# EAGLE design FLASH (EAGLE 6.2)
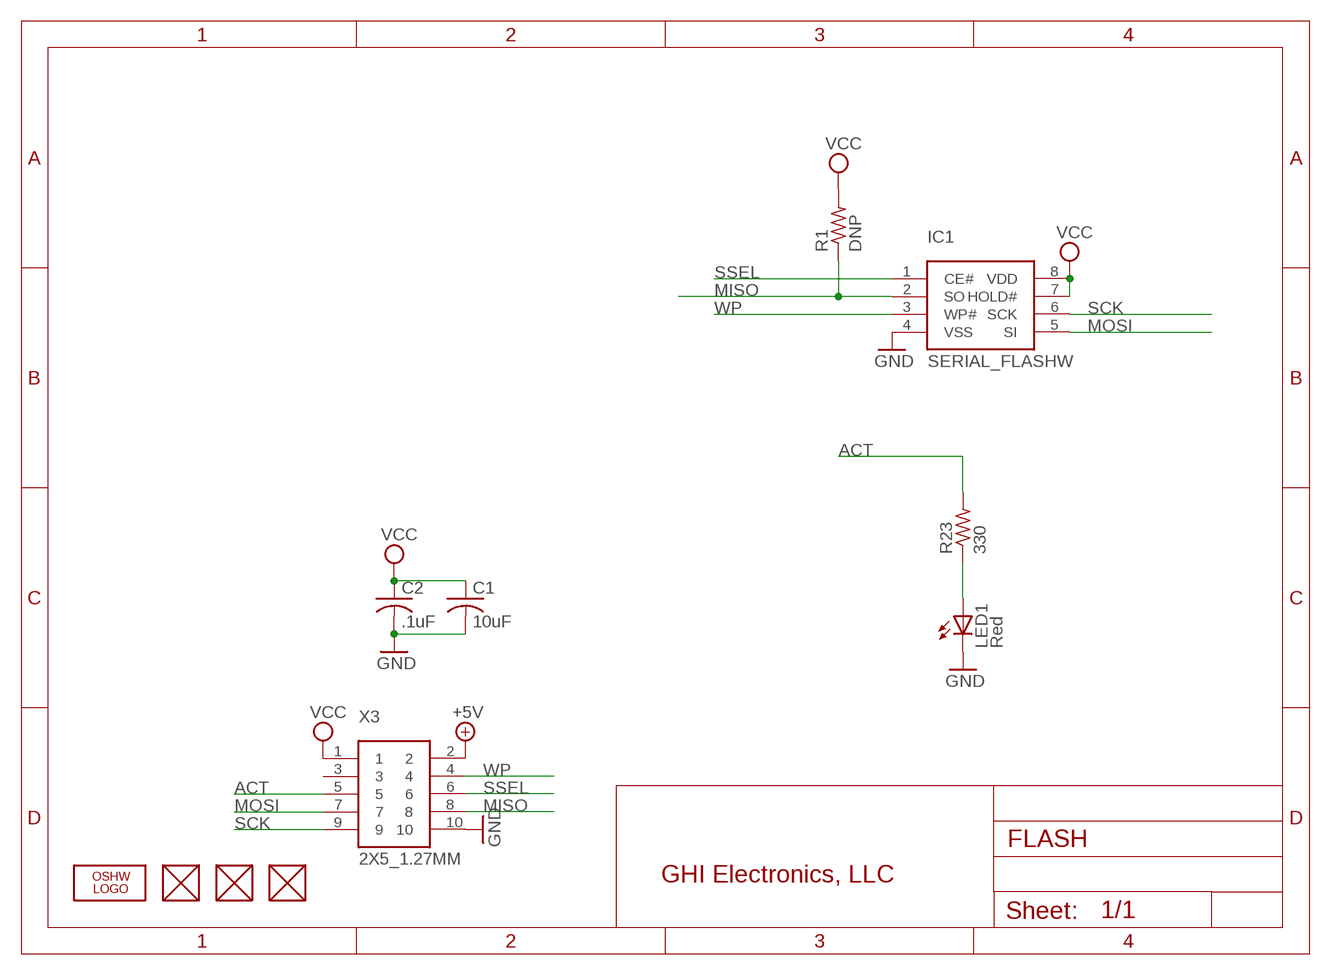
[diagram p0: schematic, sheet 1]

## Parts
C1  10uF  C-USC0805K  [C0805K]
C2  .1uF  C-USC0603K  [C0603K]
FUD1  FIDUCIAL  [FIDUCIAL_40MIL]
FUD2  FIDUCIAL  [FIDUCIAL_40MIL]
FUD3  FIDUCIAL  [FIDUCIAL_40MIL]
IC1  SERIAL_FLASHW  [SO8-WIDE]
LED1  Red  LEDCHIPLED_0805  [CHIPLED_0805]
LOGO  LOGO-OSHW-FILLX0200-NT  [OSHW_FILLX200_NOTEXT]
R1  DNP  R-US_R0402  [R0402]
R23  330  R-US_R0603  [R0603]
X3  2X5_1.27MM  [2X5_1.27MM]

## Nets
+5V [power]: X3.2
ACT: R23.2 X3.5
GND [power]: C1.2 C2.2 IC1.4(VSS) LED1.C X3.10
MISO: IC1.2(SO) R1.1 X3.8
MOSI: IC1.5(SI) X3.7
N$4: LED1.A R23.1
SCK: IC1.6(SCK) X3.9
SSEL: IC1.1(CE#) X3.6
VCC [power]: C1.1 C2.1 IC1.7(HOLD#) IC1.8(VDD) R1.2 X3.1
WP: IC1.3(WP#) X3.4
Unconnected: FUD1.P$1 FUD2.P$1 FUD3.P$1 X3.3

## Notes on the sheet
- GHI Electronics, LLC

## Library data of the parts
C1 C2 = rcl:C-US: CAPACITOR, American symbol
FUD1-FUD3 = GHI:FIDUCIAL
IC1 = GHI:SERIAL_FLASH
LED1 = led:LED: LED OSRAM: - CHIPLED LG R971, LG N971, LY N971, LG Q971, LY Q971, LO R971, LY R971 LH N974, LH R974 LS Q976, LO Q976, LY Q976 LO Q996 - Hyper CHIPLED LW Q18S LB Q993, LB Q99A, LB R99A - SideLED LS A670, LO A670, LY A670, LG A670, LP A670 LB A673, LV A673, LT A673, LW A673 LH A674 LY A675 LS A676, LA A676, LO A676, LY A676, LW A676 LS A679, LY A679, LG A679 - Hyper Micro SIDELED® LS Y876, LA Y876, LO Y876, LY Y876 LT Y87S - SmartLED LW L88C, LW L88S LB L89C, LB L89S, LG L890 LS L89K, LO L89K, LY L89K LS L896, LA L896, LO L896, LY L896 - TOPLED LS T670, LO T670, LY T670, LG T670, LP T670 LSG T670, LSP T670, LSY T670, LOP T670, LYG T670 LG T671, LOG T671, LSG T671 LB T673, LV T673, LT T673, LW T673 LH T674 LS T676, LA T676, LO T676, LY T676, LB T676, LH T676, LSB T676, LW T676 LB T67C, LV T67C, LT T67C, LS T67K, LO T67K, LY T67K, LW E67C LS E67B, LA E67B, LO E67B, LY E67B, LB E67C, LV E67C, LT E67C LW T67C LS T679, LY T679, LG T679 LS T770, LO T770, LY T770, LG T770, LP T770 LB T773, LV T773, LT T773, LW T773 LH T774 LS E675, LA E675, LY E675, LS T675 LS T776, LA T776, LO T776, LY T776, LB T776 LHGB T686 LT T68C, LB T68C - Hyper Mini TOPLED® LB M676 - Mini TOPLED Santana® LG M470 LS M47K, LO M47K, LY M47K Source: http://www.osram.convergy.de LUXEON: - LUMILED® LXK2-PW12-R00, LXK2-PW12-S00, LXK2-PW14-U00, LXK2-PW14-V00 LXK2-PM12-R00, LXK2-PM12-S00, LXK2-PM14-U00 LXK2-PE12-Q00, LXK2-PE12-R00, LXK2-PE12-S00, LXK2-PE14-T00, LXK2-PE14-U00 LXK2-PB12-K00, LXK2-PB12-L00, LXK2-PB12-M00, LXK2-PB14-N00, LXK2-PB14-P00, LXK2-PB14-Q00 LXK2-PR12-L00, LXK2-PR12-M00, LXK2-PR14-Q00, LXK2-PR14-R00 LXK2-PD12-Q00, LXK2-PD12-R00, LXK2-PD12-S00 LXK2-PH12-R00, LXK2-PH12-S00 LXK2-PL12-P00, LXK2-PL12-Q00, LXK2-PL12-R00 Source: www.luxeon.com KINGBRIGHT: KA-3528ASYC Source: www.kingbright.com
LOGO = Logo:LOGO-OSHW-FILL
R1 R23 = rcl:R-US_: RESISTOR, American symbol
X3 = GHI:2X5_1.27MM

## Board
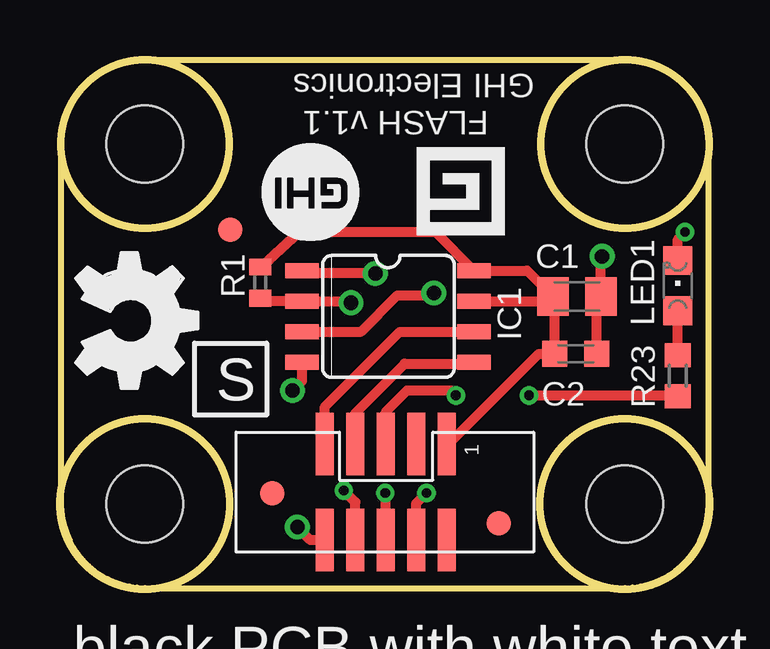
[diagram p1: board, top side]
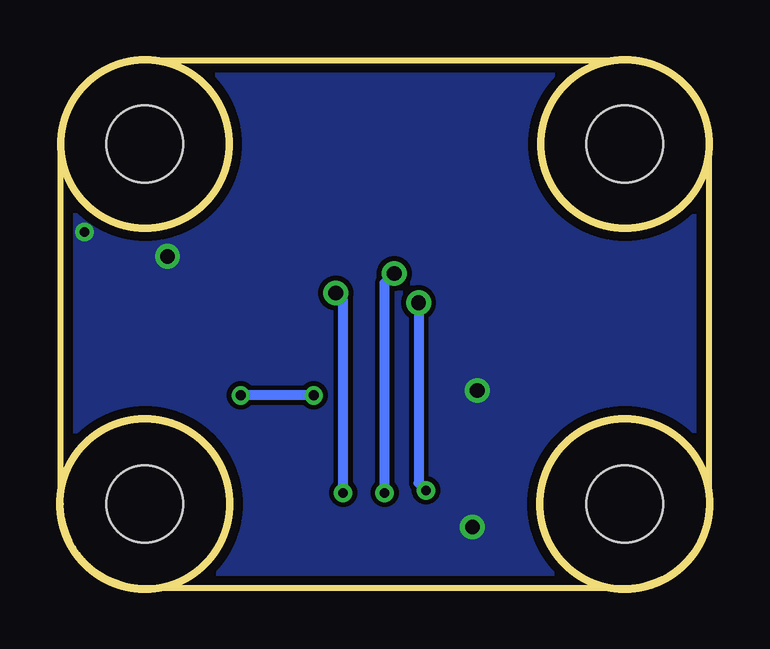
[diagram p2: board, bottom side, seen from below]

Size 27.07 x 22.04 mm. Coordinates in mm from the lower left corner, seen from the top.
Outline: 0.04,3.54 arc90 3.54,0.04 23.54,0.04 arc90 27.04,3.54 27.04,18.54 arc90 23.54,22.04 3.54,22.04 arc90 0.04,18.54 0.04,3.54
Outline: circle at 3.54,18.54 radius 3.5
Outline: circle at 23.54,18.54 radius 3.5
Outline: circle at 23.54,3.54 radius 3.54
Outline: circle at 3.54,3.54 radius 3.54
Copper layers (1+16): Top 0.035mm / dielectric 1.5mm / Bottom 0.035mm
Design rules: minimum track width 8mil, minimum drill 12mil, track to track 8mil, track to pad 8mil, pad to pad 8mil, via to via 8mil, smd to smd 8mil, copper to edge 15mil, drill to drill 8mil, minimum pad ring 10mil, minimum via ring 7mil, stop-mask expansion 4mil, vias tented up to drill 50mil, thermal gap 10mil
Holes 3.2 mm at 3.54,3.54 23.54,18.54 3.54,18.54 23.54,3.54

### Footprints (pad centres in the part's own frame; a part is rotated, then mirrored left to right if it is on the bottom)
C0805K = smd 1.3 x 1.6: 1 -1,0; 2 1,0
C0603K = smd 1.05 x 1.08: 1 -0.875,0; 2 0.875,0
FIDUCIAL_40MIL = smd 1.016 x 1.016: P$1 0,0
SO8-WIDE = smd 0.635 x 1.397: 1 -1.905,-3.581; 2 -0.635,-3.581; 3 0.635,-3.581; 4 1.905,-3.581; 5 1.905,3.581; 6 0.635,3.581; 7 -0.635,3.581; 8 -1.905,3.581
CHIPLED_0805 = smd 1.2 x 1.2: A 0,-1.05; C 0,1.05
R0402 = smd 0.7 x 0.9: 1 -0.65,0; 2 0.65,0
R0603 = smd 1 x 1.1: 1 -0.85,0; 2 0.85,0
2X5_1.27MM = smd 2.6 x 0.74: 1 -2,2.58; 2 2,2.58; 3 -2,1.31; 4 2,1.31; 5 -2,0.04; 6 2,0.04; 7 -2,-1.23; 8 2,-1.23; 9 -2,-2.5; 10 2,-2.5

### Placement (x,y rotation side)
C1  21.54,12.18 0 top
C2  21.49,9.79 0 top
FUD1  7.1,14.97 0 top
FUD2  18.29,2.73 0 top
FUD3  8.85,3.98 0 top
IC1  13.66,11.35 270 top
LED1  25.74,12.63 0 top
LOGO  0.65,14.01 270 top
R1  8.34,12.76 90 top
R23  25.74,8.87 270 top
X3  13.54,4.04 270 top

### Tracks (layer width: path | path; a pad name or v marks a point on that pad's centre or on a via)
ACT  (via drill 0.41)
  Top 0.406: X3.5 13.58,7.38 14.46,8.27 16.29,8.27 v16.49,8.06 | v19.54,8.06 25.7,8.06 R23.2
  Bottom 0.406: v16.49,8.06 v19.54,8.06
GND  (via drill 0.41, 0.61)
  Top 0.406: IC1.4 10.08,8.66 v9.69,8.27 | X3.10 10.43,2.04 v9.89,2.58 | 22.54,9.97 C2.2 22.36,12.01 C1.2 22.54,13.8 v22.59,13.85 | LED1.C 25.74,14.56 v26.05,14.87
  pour Bottom: 26.92,-0.07 26.92,22.2 0.04,22.2 0.04,-0.07
MISO  (via drill 0.41, 0.61)
  Top 0.406: R1.1 8.09,11.98 IC1.2 12.06,11.98 v12.13,11.92 | X3.8 12.31,3.62 v11.82,4.1
  Bottom 0.406: v12.13,11.92 12.13,4.4 v11.82,4.1
MOSI
  Top 0.406: X3.7 12.31,7.33 14.36,9.38 17.18,9.38 IC1.5
N$4
  Top 0.406: R23.1 LED1.A
SCK
  Top 0.406: IC1.6 17.23,10.7 14.16,10.7 11.04,7.58 X3.9
SSEL  (via drill 0.41, 0.61)
  Top 0.406: X3.6 13.58,3.97 v13.55,4 | v13.14,13.14 10.19,13.14 IC1.1
  Bottom 0.406: v13.55,4 13.55,12.74 v13.14,13.14
VCC
  Top 0.406: IC1.7 20.34,11.98 C1.1 | C1.1 19.46,13.25 IC1.8 15.63,14.87 9.99,14.87 8.71,13.68 R1.2 | X3.1 16.12,5.96 19.95,9.79 C2.1 20.61,12.1 C1.1
WP  (via drill 0.41, 0.61)
  Top 0.406: X3.4 14.85,3.57 v15.28,4 | IC1.3 12.54,10.71 14.06,12.23 15.48,12.23 v15.58,12.33
  Bottom 0.406: v15.28,4 15.28,12.02 v15.58,12.33

### Text on the board
tPlace: GHI Electronics | FLASH v1.1 | S | black PCB with white text | corner holes are nonplated | do not add manufacturing codes